# Altium schematic sheet RFPA_PA_OUT.SchDoc: RFPA Power amplifier section
size A3; Author: Maciej Urbański; Revision: 1.0; SheetNumber: 1; SheetTotal: 1; Comments: Power amplifier section for RFPA; Wersja: 1.0; CustomerInfo: Technosystem sp. z.o.o; CustomerAddress: ul. Okulickiego 7/9 05-500 Piaseczno, NIP 1231350775; CopyrightDate: 2018; TopSheet: RFPA_PA_OUT.SchDoc; CurrentSheet: RFPA_PA_OUT; ProjectName: RFPA
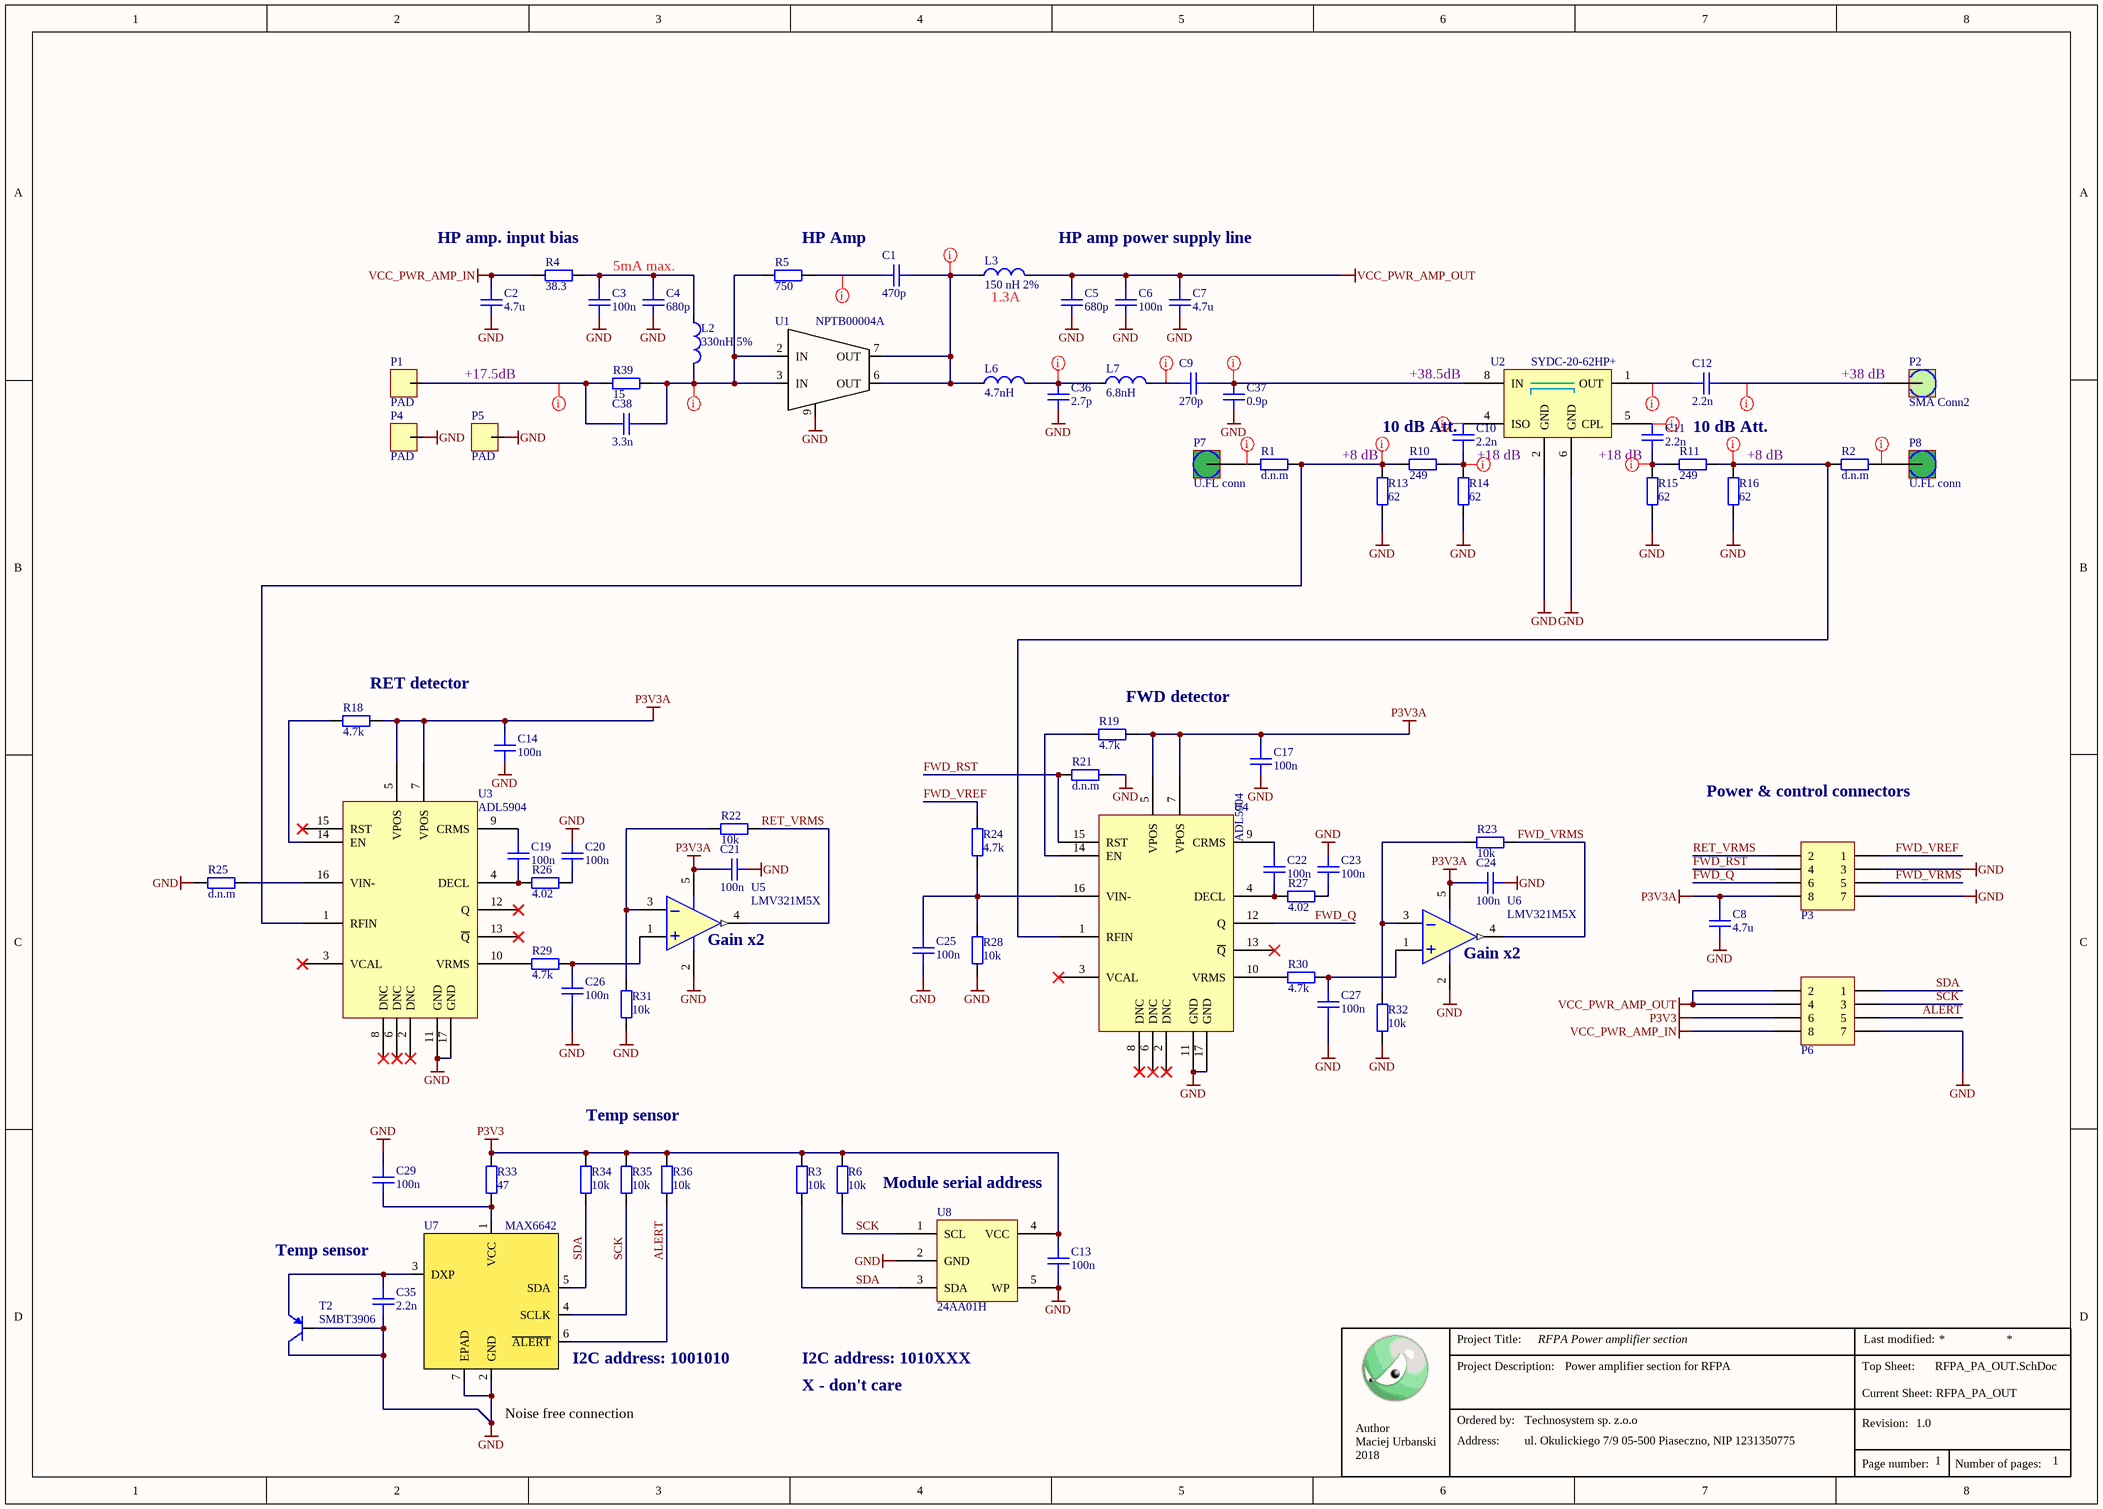
[diagram p0: RFPA_PA_OUT.SchDoc]

## Parts
C1  470p  [0603_ZE]
C2  4.7u  [0603_ZE]
C3  100n  [0402_ZE]
C4  680p  [0603_ZE]
C5  680p  [0603_ZE]
C6  100n  [0402_ZE]
C7  4.7u  [chip_c_0805]
C8  4.7u  [chip_c_0805]
C9  270p  [0603_ZE]
C10  2.2n  [0603_ZE]
C11  2.2n  [0603_ZE]
C12  2.2n  [0603_ZE]
C13  100n  [0402_ZE]
C14  100n  [0402_ZE]
C17  100n  [0402_ZE]
C19  100n  [0402_ZE]
C20  100n  [0402_ZE]
C21  100n  [0402_ZE]
C22  100n  [0402_ZE]
C23  100n  [0402_ZE]
C24  100n  [0402_ZE]
C25  100n  [0402_ZE]
C26  100n  [0402_ZE]
C27  100n  [0402_ZE]
C29  100n  [0402_ZE]
C35  2.2n  [0603_ZE]
C36  2.7p  [0603_ZE]
C37  0.9p  [0603_ZE]
C38  3.3n  [0603_ZE]
L2  330nH 5%  [0603_IND]
L3  150 nH 2%  [0603_IND]
L6  4.7nH  [0603_IND]
L7  6.8nH  [0603_IND]
P1  PAD  [PAD_2x3_rect]
P2  SMA Conn2  [MOLEX_73251-2121]
P3  HDR2X4  [HDR2X4_SMD]  (value not drawn)
P4  PAD  [PAD_2x3_rect]
P5  PAD  [PAD_2x3_rect]
P6  HDR2X4  [HDR2X4_SMD]  (value not drawn)
P7  U.FL conn  [HIROSE_U.FL-R-SMT-1(10)]
P8  U.FL conn  [HIROSE_U.FL-R-SMT-1(10)]
R1  d.n.m  [0603_ZE]
R2  d.n.m  [0603_ZE]
R3  10k  [0402_ZE]
R4  38.3  [0603_ZE]
R5  750  [0603_ZE]
R6  10k  [0402_ZE]
R10  249  [0603_ZE]
R11  249  [0603_ZE]
R13  62  [0603_ZE]
R14  62  [0603_ZE]
R15  62  [0603_ZE]
R16  62  [0603_ZE]
R18  4.7k  [0402_ZE]
R19  4.7k  [0402_ZE]
R21  d.n.m  [0402_ZE]
R22  10k  [0402_ZE]
R23  10k  [0402_ZE]
R24  4.7k  [0402_ZE]
R25  d.n.m  [0402_ZE]
R26  4.02  [0402_ZE]
R27  4.02  [0402_ZE]
R28  10k  [0402_ZE]
R29  4.7k  [0402_ZE]
R30  4.7k  [0402_ZE]
R31  10k  [0402_ZE]
R32  10k  [0402_ZE]
R33  47  [0603_ZE]
R34  10k  [0402_ZE]
R35  10k  [0402_ZE]
R36  10k  [0402_ZE]
R39  15  [0603_ZE]
T2  SMBT3906  [SOT23]
U1  NPTB00004A  [SO8_RF_power]
U2  SYDC-20-62HP+  [AH202_1]
U3  ADL5904  [QFN50P300X300X80-17N-S125]
U4  ADL5904  [QFN50P300X300X80-17N-S125]
U5  LMV321M5X  [SOT23-5_N]
U6  LMV321M5X  [SOT23-5_N]
U7  MAX6642  [TDFN-6]
U8  24AA01H  [SOT23-5_N]

## Nets
GND: C2.1 C3.1 C4.1 C5.1 C6.1 C7.1 C8.1 C13.1 C14.1 C17.1 C20.2 C21.1 C23.2 C24.1 C25.1 C26.1 C27.1 C29.1 C35.1 C36.1 C37.2 P2.2(GND) P3.3 P3.7 P4.1 P5.1 P6.7 P7.2(GND) P8.2(GND) R13.2 R14.2 R15.2 R16.2 R21.1 R25.2 R28.2 R31.2 R32.2 T2.1(B) T2.3(C) U1.9(GND) U2.2(GND) U2.6(GND) U3.11(GND) U3.17(GND) U4.11(GND) U4.17(GND) U5.2(V-) U6.2(V-) U7.2(GND) U7.7(EPAD) U8.2(GND) U8.5(WP)
P3V3: C13.2 P6.6 R3.1 R6.1 R33.1 R34.1 R35.1 R36.1 U8.4(VCC)
P3V3A: C8.2 C14.2 C17.2 C21.2 C24.2 P3.8 R18.1 R19.1 U3.5(VPOS) U3.7(VPOS) U4.5(VPOS) U4.7(VPOS) U5.5(V+) U6.5(V+)
VCC_PWR_AMP_IN: C2.2 P6.8 R4.1
VCC_PWR_AMP_OUT: C5.2 C6.2 C7.2 L3.2 P6.2 P6.4
ALERT: P6.5 R36.2 U7.6(~{ALERT})
FWD_Q: P3.6 U4.12(Q)
FWD_RST: P3.4 R21.2 U4.15(RST)
FWD_VREF: P3.1 R24.1
FWD_VRMS: P3.5 R23.1 U6.4(OUT)
RET_VRMS: P3.2 R22.1 U5.4(OUT)
SCK: P6.3 R6.2 R35.2 U7.4(SCLK) U8.1(SCL)
SDA: P6.1 R3.2 R34.2 U7.5(SDA) U8.3(SDA)
NetC1_1: C1.1 L3.1 L6.1 U1.6(OUT) U1.7(OUT)
NetC1_2: C1.2 R5.2
NetC3_2: C3.2 C4.2 L2.1 R4.2
NetC9_1: C9.1 C37.1 U2.8(IN)
NetC9_2: C9.2 L7.2
NetC10_1: C10.1 R10.2 R14.1
NetC10_2: C10.2 U2.4(ISO)
NetC11_1: C11.1 R11.1 R15.1
NetC11_2: C11.2 U2.5(CPL)
NetC12_1: C12.1 P2.1
NetC12_2: C12.2 U2.1(OUT)
NetC19_1: C19.1 R26.2 U3.4(DECL)
NetC19_2: C19.2 U3.9(CRMS)
NetC20_1: C20.1 R26.1
NetC22_1: C22.1 R27.2 U4.4(DECL)
NetC22_2: C22.2 U4.9(CRMS)
NetC23_1: C23.1 R27.1
NetC25_2: C25.2 R24.2 R28.1 U4.16(VIN-)
NetC26_2: C26.2 R29.1 U5.1(IN+)
NetC27_2: C27.2 R30.1 U6.1(IN+)
NetC29_2: C29.2 R33.2 U7.1(VCC)
NetC35_2: C35.2 T2.2(E) U7.3(DXP)
NetC36_2: C36.2 L6.2 L7.1
NetC38_1: C38.1 L2.2 R5.1 R39.2 U1.2(IN) U1.3(IN)
NetC38_2: C38.2 P1.1 R39.1
NetP7_1: P7.1 R1.1
NetP8_1: P8.1 R2.2
NetR1_2: R1.2 R10.1 R13.1 U3.1(RFIN)
NetR2_1: R2.1 R11.2 R16.1 U4.1(RFIN)
NetR18_2: R18.2 U3.14(EN)
NetR19_2: R19.2 U4.14(EN)
NetR22_2: R22.2 R31.1 U5.3(IN-)
NetR23_2: R23.2 R32.1 U6.3(IN-)
NetR25_1: R25.1 U3.16(VIN-)
NetR29_2: R29.2 U3.10(VRMS)
NetR30_2: R30.2 U4.10(VRMS)

Not connected (* = marked no-connect by the designer): U3 2(DNC)* 3(VCAL)* 6(DNC)* 8(DNC)* 12(Q)* 13(~{Q})* 15(RST)*; U4 2(DNC)* 3(VCAL)* 6(DNC)* 8(DNC)* 13(~{Q})*

## Layout directives
net class 50_Ohm: NetC1_1, NetC1_2, NetC9_1, NetC9_2, NetC10_1, NetC10_2, NetC11_1, NetC11_2, NetC12_1, NetC12_2, NetC36_2, NetC38_1, NetC38_2, NetP7_1, NetP8_1, NetR1_2, NetR2_1

## Notes on the sheet
- HP amp. input bias
- HP Amp
- HP amp power supply line
- 5mA max.
- (near L3) 1.3A
- +17.5dB
- +38.5dB
- (near P2) +38 dB
- (near C10) 10 dB Att.
- 10 dB Att.
- (near R13) +8 dB
- +18 dB
- (near R16) +8 dB
- (near R18) RET detector
- (near R19) FWD detector
- Power & control connectors
- (near U5) Gain x2
- (near U6) Gain x2
- Temp sensor
- Module serial address
- (near C35) Temp sensor
- (near U7) I2C address: 1001010
- I2C address: 1010XXX
- X - don't care
- (near U7) Noise free connection
- Project Title:
- Project Description:
- Top Sheet:
- Current Sheet:
- Last modified:
- Author
- Maciej Urbanski
- Ordered by:
- Address:
- Revision:
- Page number:
- Number of pages:

## Library data of the parts
C1 = C: Capacitor; Manufacturer: Multicomp; Manufacturer Part Number: MCMT18N471F500CT; Remarks: Tolerance 1%; Generic: yes; Value: 470p; Mounting type: SMT; Package: 0603; Supplier 1: Farnell; Supplier 2: -; Supplier 3: -; Supplier Part Number 1: 1856153; Supplier Part Number 2: -; Supplier Part Number 3: -
C2 = C: Capacitor; Manufacturer: Murata; Manufacturer Part Number: GRM188R61C475KAAJD; Generic: yes; Value: 4.7u; Mounting type: SMT; Package: 0603; Remarks: -; Supplier 1: Farnell; Supplier 2: Mouser; Supplier 3: Digikey; Supplier Part Number 1: 2611924RL; Supplier Part Number 2: 81-GRM188R61C475KAJD; Supplier Part Number 3: 490-10481-1-ND
C3 C6 C13 C14 C17 C19-C27 C29 C35 = C: Capacitor; Manufacturer: Murata; Manufacturer Part Number: GRM155R61H104KE19D; Generic: yes; Mounting type: SMT; Remarks: -; Supplier 1: Mouser; Supplier 2: Digi Key; Supplier 3: Farnell; Supplier Part Number 1: 81-GRM155R61H104KE9D; Supplier Part Number 2: 490-11917-1-ND; Supplier Part Number 3: 2218856
  C3 C6 C13 C14 C17 C19-C27 C29: Value: 100n; Package: 0402
  C35: Value: 2.2n; Package: 0603
C4 C5 = C: Capacitor; Manufacturer: Multicomp; Manufacturer Part Number: MCMT18N681F500CT; Remarks: Tolerance 1%; Generic: yes; Value: 680p; Mounting type: SMT; Package: 0603; Supplier 1: Farnell; Supplier 2: -; Supplier 3: -; Supplier Part Number 1: 1856154RL; Supplier Part Number 2: -; Supplier Part Number 3: -
C7 C8 = C: Capacitor; Manufacturer: Murata; Manufacturer Part Number: GRT21BR61H475KE13L; Generic: yes; Value: 4.7u; Mounting type: SMT; Package: 0805; Remarks: -; Supplier 1: Farnell; Supplier 2: Mouser; Supplier 3: Digikey; Supplier Part Number 1: 1856154RL; Supplier Part Number 2: 81-GRT21BR61H475KE3L; Supplier Part Number 3: 490-12394-1-ND
C9 = C: Capacitor; Manufacturer: Kemet; Manufacturer Part Number: C0603C271F5GACTU; Remarks: Tolerance 1%; Generic: yes; Value: 270p; Mounting type: SMT; Package: 0603; Supplier 1: Mouser; Supplier 2: Digi Key; Supplier 3: Farnell; Supplier Part Number 1: 80-C0603C271F5G; Supplier Part Number 2: 399-9054-1-ND; Supplier Part Number 3: 2581060
C10-C12 = C: Capacitor; Manufacturer: Murata; Manufacturer Part Number: GRM1885C1H222FA01D; Generic: yes; Value: 2.2n; Mounting type: SMT; Package: 0603; Remarks: -; Supplier 1: Mouser; Supplier 2: Digi Key; Supplier 3: Farnell; Supplier Part Number 1: 81-GRM1885C1H222FA1D; Supplier Part Number 2: 490-7768-1-ND; Supplier Part Number 3: 2470481
C36 = C: Capacitor; Manufacturer: Murata; Manufacturer Part Number: GRM1885C1H2R7BA01D; Generic: yes; Value: 2.7p; Mounting type: SMT; Package: 0603; Remarks: -; Supplier 1: Mouser; Supplier 2: Digi Key; Supplier 3: Farnell; Supplier Part Number 3: 2688510
C37 = C: Capacitor; Manufacturer: AVX; Manufacturer Part Number: ML03510R9AAT2A; Remarks: Tolerance 1%; Generic: yes; Value: 0.9p; Mounting type: SMT; Package: 0603; Supplier 1: Mouser; Supplier 2: Digi Key; Supplier 3: -; Supplier Part Number 1: 581-ML03510R9AAT2A; Supplier Part Number 2: 478-6731-1-ND; Supplier Part Number 3: -
C38 = C: Capacitor; Manufacturer: Kemet; Manufacturer Part Number: C0603C332F5GACTU; Generic: yes; Value: 3.3n; Mounting type: SMT; Package: 0603; Remarks: -; Supplier 1: Mouser; Supplier 2: Digi Key; Supplier 3: Farnell; Supplier Part Number 3: 2581062
L2 = Inductor: Manufacturer: Murata; Manufacturer Part Number: LQW18CNR33J00D; Generic: no; Remarks: Tolerance 5%; Value: 330nH 5%; Mounting type: SMT; Package: 0603; Supplier 1: Farnell; Supplier 2: Mouser; Supplier 3: Digikey; Supplier Part Number 1: 2219329; Supplier Part Number 2: 81-LQW18CNR33J00D; Supplier Part Number 3: 490-10772-1-ND
L3 = Inductor: Manufacturer: Coilcraft; Manufacturer Part Number: 0603LS-151XGLB; Generic: no; Remarks: Tolerance 5%; Value: 150 nH 2%; Mounting type: SMT; Package: 0603; Supplier 1: Farnell; Supplier 2: Mouser; Supplier 3: -; Supplier Part Number 1: 2286250; Supplier Part Number 2: 994-0603LS-151XGLB; Supplier Part Number 3: -
L6 = Inductor: Manufacturer: Murata; Manufacturer Part Number: LQW18AN4N7G8ZD; Generic: no; Remarks: Tolerance 2%; Value: 4.7nH; Mounting type: SMT; Package: 0603; Supplier 1: -; Supplier 2: Mouser; Supplier 3: Digikey; Supplier Part Number 1: -; Supplier Part Number 2: 81-LQW18AN4N7G8ZD; Supplier Part Number 3: 490-15710-1-ND
L7 = Inductor: Manufacturer: Murata; Manufacturer Part Number: LQW18AN6N8G8ZD; Generic: no; Remarks: Tolerance 2%; Value: 6.8nH; Mounting type: SMT; Package: 0603; Supplier 1: -; Supplier 2: Mouser; Supplier 3: Digikey; Supplier Part Number 1: -; Supplier Part Number 2: 81-LQW18AN4N7G8ZD; Supplier Part Number 3: 490-15733-1-ND
P1 P4 P5 = PAD: Generic: no; Remarks: PCB PAD; Value: -; Manufacturer: -; Manufacturer Part Number: -; Mounting type: -; Package: -; Supplier 1: -; Supplier 2: -; Supplier 3: -; Supplier Part Number 1: -; Supplier Part Number 2: -; Supplier Part Number 3: -
P2 = SMA Conn2: SMA Connector 142-0711-301; Manufacturer: Molex; Manufacturer Part Number: 73251-2120; Generic: no; Mounting type: SMT; Package: SMA; Remarks: -; Supplier 1: Farnell; Supplier 2: Mouser; Supplier 3: -; Supplier Part Number 1: 1909303; Supplier Part Number 2: 538-73251-2120; Supplier Part Number 3: -; Value: -
P3 P6 = HDR2X4: Header, 4-Pin, Dual Row; Generic: yes; Remarks: ordinary goldpin socket; Value: -; Manufacturer: -; Manufacturer Part Number: -; Mounting type: SMT; Package: 2x4 pin SMD; Supplier 1: TME; Supplier 2: -; Supplier 3: -; Supplier Part Number 1: ZL264-8DG; Supplier Part Number 2: -; Supplier Part Number 3: -
P7 P8 = U.FL socket: Hiroso U.FL series RF connector fmax 6GHz; Manufacturer: Hirose; Manufacturer Part Number: U.FL-R-SMT(01); Generic: yes; Remarks: Can be replaced with any u.FL connector; Mounting type: SMT; Value: -; Package: u.FL SMD; Supplier 1: Farnell; Supplier 2: Mouser; Supplier 3: Digikey; Supplier Part Number 1: 1688077; Supplier Part Number 2: 798-U.FL-R-SMT-110; Supplier Part Number 3: H11891CT-ND
R1 R2 R21 R25 = R2: Resistor; Value: d.n.m; Manufacturer: -; Mounting type: -; Generic: -; Manufacturer Part Number: -; Package: -; Remarks: -; Supplier 1: -; Supplier 2: -; Supplier 3: -; Supplier Part Number 1: -; Supplier Part Number 2: -; Supplier Part Number 3: -
R3 R5 R6 R18 R19 R22-R24 R26-R36 = R2: Resistor; Generic: yes; Remarks: Tolerance 1%; Manufacturer: -; Mounting type: SMT; Manufacturer Part Number: -; Supplier 1: -; Supplier 2: -; Supplier 3: -; Supplier Part Number 1: -; Supplier Part Number 2: -; Supplier Part Number 3: -
  R3 R6 R22 R23 R28 R31 R32 R34-R36: Value: 10k; Package: 0402
  R5: Value: 750; Package: 0603
  R18 R19 R24 R29 R30: Value: 4.7k; Package: 0402
  R26 R27: Value: 4.02; Package: 0402
  R33: Value: 47; Package: 0603
R4 = R2: Resistor; Manufacturer: Panasonic; Manufacturer Part Number: ERJPA3F38R3V; Generic: no; Remarks: Power 250 mW; Value: 38.3; Mounting type: SMT; Package: 0603; Supplier 1: Farnell; Supplier 2: Mouser; Supplier 3: Digikey; Supplier Part Number 1: 2562009; Supplier Part Number 2: 667-ERJ-PA3F38R3V; Supplier Part Number 3: ERJ-PA3F38R3V-ND
R10 R11 = R2: Resistor; Manufacturer: Panasonic; Manufacturer Part Number: ERJPA3F2490V; Generic: no; Remarks: Power 250 mW; Value: 249; Mounting type: SMT; Package: 0603; Supplier 1: Farnell; Supplier 2: Mouser; Supplier 3: Digikey; Supplier Part Number 1: 2561903
R13-R16 = R2: Resistor; Manufacturer: Panasonic; Manufacturer Part Number: ERJPA3F62R0V; Generic: no; Remarks: Power 250 mW; Value: 62; Mounting type: SMT; Package: 0603; Supplier 1: Mouser; Supplier 2: Digi Key; Supplier 3: Farnell; Supplier Part Number 3: 2335940
R39 = R2: Resistor; Manufacturer: Panasonic; Manufacturer Part Number: ERJPA3F15R0V; Generic: no; Remarks: Power 250 mW; Value: 15; Mounting type: SMT; Package: 0603; Supplier 1: Farnell; Supplier 2: Mouser; Supplier 3: Digikey; Supplier Part Number 1: 2335857; Supplier Part Number 2: 667-ERJ-PA3F15R0V; Supplier Part Number 3: P15.00BYCT-ND
T2 = BC856: PNP Bipolar Transistor; Manufacturer: Infineon; Manufacturer Part Number: SMBT 3906 E6327; Generic: no; Mounting type: SMD; Package: SOT-23; Remarks: -; Supplier 1: Mouser; Supplier 2: Digikey; Supplier 3: -; Supplier Part Number 1: 726-SMBT3906E6327; Supplier Part Number 2: SMBT3906E6327HTSA1TR-ND; Supplier Part Number 3: -; Value: -
U1 = NPTB00004A: GaN Wideband Transistor amplifier 28V, 5W, DC-6GHz; Manufacturer: Macom; Generic: no; Manufacturer Part Number: NPTB00004A; Mounting type: SMT; Package: SO8 power pad; Remarks: -; Supplier 1: Mouser; Supplier 2: Digikey; Supplier 3: -; Supplier Part Number 1: 937-NPTB00004A; Supplier Part Number 2: 1465-1410-ND; Supplier Part Number 3: -; Value: -
U2 = SYDC-10-62-HP+: SMD Bi-directional coupler; Manufacturer: Mini Circuits; Generic: no; Value: SYDC-20-62HP+; Manufacturer Part Number: SYDC-20-62HP+; Mounting type: SMT; Package: AH202-1; Remarks: -; Supplier 1: Municom; Supplier 2: -; Supplier 3: -; Supplier Part Number 1: SYDC-20-62HP+; Supplier Part Number 2: -; Supplier Part Number 3: -
U3 U4 = ADL5904: DC to 6 GHz 45dB TruPwr Detector with Envelope Threshold Detection; Manufacturer: Analog Devices; Generic: no; Value: -; Manufacturer Part Number: ADL5904; Mounting type: SMT; Package: LFCSP-16; Remarks: -; Supplier 1: Mouser; Supplier 2: Digi Key; Supplier 3: -; Supplier Part Number 1: 584-ADL5904ACPZN-R7; Supplier Part Number 2: ADL5904ACPZN-R7CT-ND; Supplier Part Number 3: -
U5 U6 = LMV321M5X: Single General Purpose Low voltage Rail to Rail Output Op amp; Manufacturer: TI; Generic: no; Manufacturer part number: LMV321M5X; Value: -; Mounting type: SMT; Package: SOT23-6; Remarks: -; Supplier 1: Mouser; Supplier 2: Farnell; Supplier 3: Digikey; Supplier Part Number 1: 926-LMV321M5X/NOPB; Supplier Part Number 2: 2764711; Supplier Part Number 3: LMV321M5X/NOPBCT-ND
U7 = MAX6642: +/-1 degree SMBus-Compatible Remote/Local Temperature sensor with overtemperature alarm; Manufacturer: Maxim; Manufacturer Part Number: MAX6642ATT94+T; Generic: no; Mounting type: SMT; Package: DFN6; Remarks: -; Supplier 1: Farnell; Supplier 2: Mouser; Supplier 3: Digikey; Supplier Part Number 1: 2799245; Supplier Part Number 2: 700-MAX6642ATT94+T; Supplier Part Number 3: MAX6642ATT94+T-ND; Value: -
U8 = 24AA01H: 1K I2  C™ Serial EEPROM with Half-Array Write-Protect; Manufacturer: Microchip; Suppier 1 part number: 579-24AA01HTILT; Manufacturer part name: 24AA01H; Supplier 1: Mouser